# Altium schematic sheet SMASHBOY_AVI_ADC_SCH_PART2_V01.SchDoc
size A4; SheetNumber: 1; SheetTotal: 1
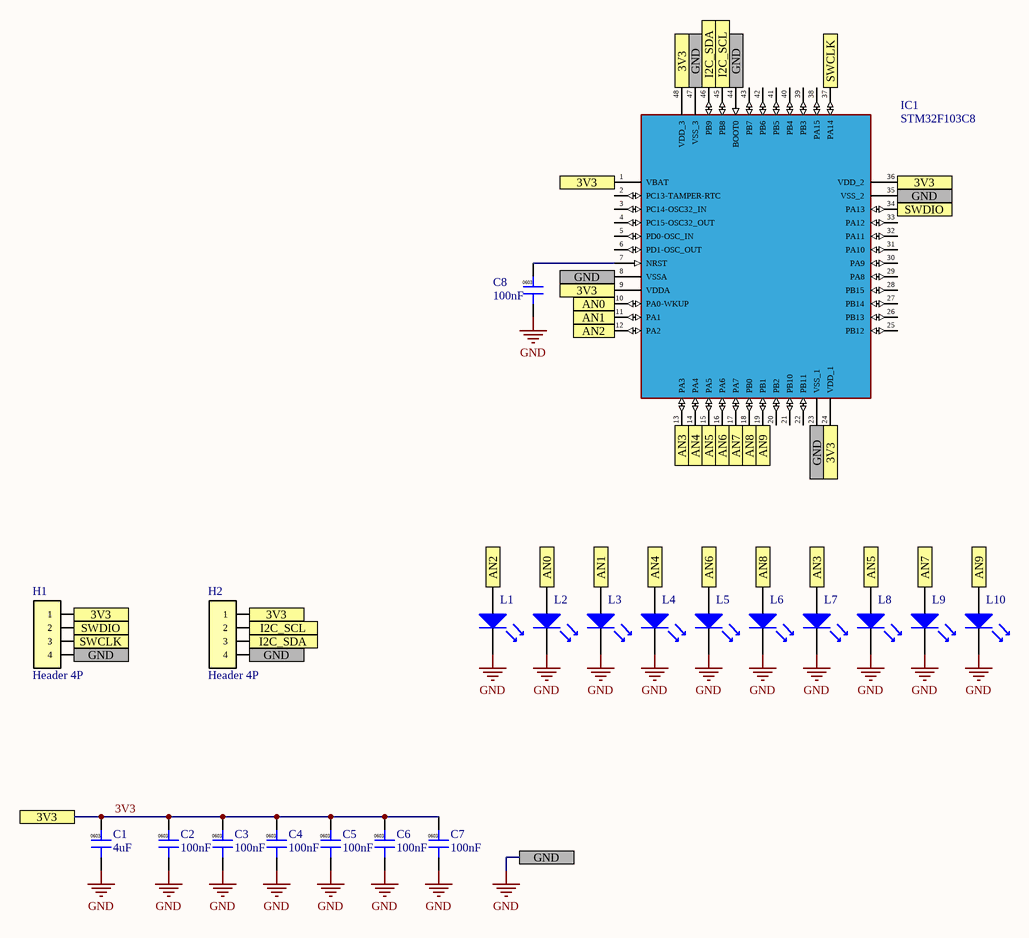
[diagram p0: SMASHBOY_AVI_ADC_SCH_PART2_V01.SchDoc]

## Parts
C1  4uF  [CAP0603_060]
C2  100nF  [CAP0603_060]
C3  100nF  [CAP0603_060]
C4  100nF  [CAP0603_060]
C5  100nF  [CAP0603_060]
C6  100nF  [CAP0603_060]
C7  100nF  [CAP0603_060]
C8  100nF  [CAP0603_060]
H1  Header 4P  [Header-4P]
H2  Header 4P  [Header-4P]
IC1  STM32F103C8  [QFP-48N]
L1  LED Azul  [LED0603]  (value not drawn)
L2  LED Azul  [LED0603]  (value not drawn)
L3  LED Azul  [LED0603]  (value not drawn)
L4  LED Azul  [LED0603]  (value not drawn)
L5  LED Azul  [LED0603]  (value not drawn)
L6  LED Azul  [LED0603]  (value not drawn)
L7  LED Azul  [LED0603]  (value not drawn)
L8  LED Azul  [LED0603]  (value not drawn)
L9  LED Azul  [LED0603]  (value not drawn)
L10  LED Azul  [LED0603]  (value not drawn)

## Ports
3V3, AN0, AN1, AN2, AN3, AN4, AN5, AN6, AN7, AN8, AN9, GND, I2C_SCL, I2C_SDA, SWCLK, SWDIO

## Nets
GND: C1.2 C2.2 C3.2 C4.2 C5.2 C6.2 C7.2 C8.2 H1.4 H2.4 IC1.8(VSSA) IC1.23(VSS_1) IC1.35(VSS_2) IC1.44(BOOT0) IC1.47(VSS_3) L1.2(K) L2.2(K) L3.2(K) L4.2(K) L5.2(K) L6.2(K) L7.2(K) L8.2(K) L9.2(K) L10.2(K) ; port GND
3V3: C1.1 C2.1 C3.1 C4.1 C5.1 C6.1 C7.1 H1.1 H2.1 IC1.1(VBAT) IC1.9(VDDA) IC1.24(VDD_1) IC1.36(VDD_2) IC1.48(VDD_3) ; port 3V3
AN0: IC1.10(PA0-WKUP) L2.1(A) ; port AN0
AN1: IC1.11(PA1) L3.1(A) ; port AN1
AN2: IC1.12(PA2) L1.1(A) ; port AN2
AN3: IC1.13(PA3) L7.1(A) ; port AN3
AN4: IC1.14(PA4) L4.1(A) ; port AN4
AN5: IC1.15(PA5) L8.1(A) ; port AN5
AN6: IC1.16(PA6) L5.1(A) ; port AN6
AN7: IC1.17(PA7) L9.1(A) ; port AN7
AN8: IC1.18(PB0) L6.1(A) ; port AN8
AN9: IC1.19(PB1) L10.1(A) ; port AN9
I2C_SCL: H2.2 IC1.45(PB8) ; port I2C_SCL
I2C_SDA: H2.3 IC1.46(PB9) ; port I2C_SDA
SWCLK: H1.3 IC1.37(PA14) ; port SWCLK
SWDIO: H1.2 IC1.34(PA13) ; port SWDIO
NetC8_1: C8.1 IC1.7(NRST)

Not connected (* = marked no-connect by the designer): IC1 2(PC13-TAMPER-RTC) 3(PC14-OSC32_IN) 4(PC15-OSC32_OUT) 5(PD0-OSC_IN) 6(PD1-OSC_OUT) 20(PB2) 21(PB10) 22(PB11) 25(PB12) 26(PB13) 27(PB14) 28(PB15) 29(PA8) 30(PA9) 31(PA10) 32(PA11) 33(PA12) 38(PA15) 39(PB3) 40(PB4) 41(PB5) 42(PB6) 43(PB7)

## Notes on the sheet
- (in symbol CAP0603) 0603

## Library data of the parts
C1-C8 = CAP0603: Capacitor SDM 0603
H1 H2 = Header-4P: Header 4 Pinos
IC1 = STM32F103C8: Medium-density performance line ARM-based 32-bit MCU. / 72 MHz, 5 V-tolerant. / 48 Pin
L1-L10 = LED0603: LED SMD 0603